# Altium schematic sheet Jammer Circuit.SchDoc
size A4
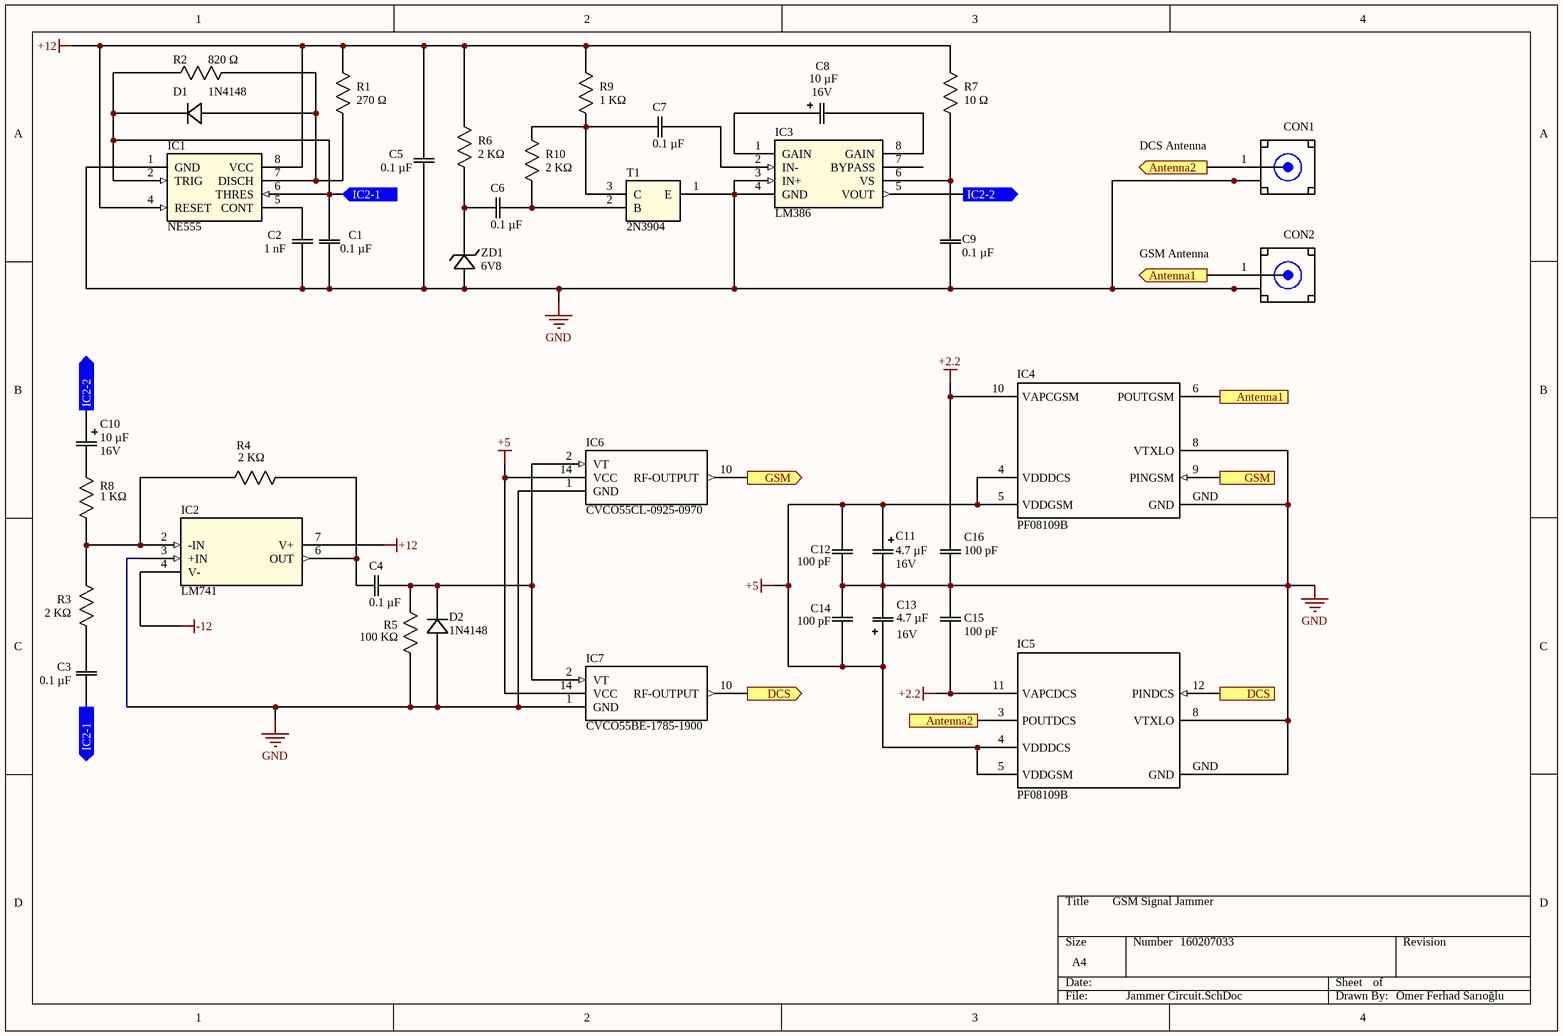
[diagram p0: Jammer Circuit.SchDoc]

## Parts
C1  value 0.1 µF  [CAP_1206J]  (hidden comment: 12062A270JAT2A)
C2  value 1 nF  [CAP_1206J]  (hidden comment: 12062A270JAT2A)
C3  value 0.1 µF  [CAP_1206J]  (hidden comment: 12062A270JAT2A)
C4  value 0.1 µF  [CAP_1206J]  (hidden comment: 12062A270JAT2A)
C5  value 0.1 µF  [CAP_1206J]  (hidden comment: 12062A270JAT2A)
C6  value 0.1 µF  [CAP_1206J]  (hidden comment: 12062A270JAT2A)
C7  value 0.1 µF  [CAP_1206J]  (hidden comment: 12062A270JAT2A)
C8  value 10 µF  Voltage: 16V  [EEE-1C]  (hidden comment: EEE-1CA221UP)
C9  value 0.1 µF  [CAP_1206J]  (hidden comment: 12062A270JAT2A)
C10  value 10 µF  Voltage: 16V  [EEE-1C]  (hidden comment: EEE-1CA221UP)
C11  value 4.7 µF  Voltage: 16V  [EEE-1C]  (hidden comment: EEE-1CA221UP)
C12  value 100 pF  [CAP_1206J]  (hidden comment: 12062A270JAT2A)
C13  value 4.7 µF  Voltage: 16V  [EEE-1C]  (hidden comment: EEE-1CA221UP)
C14  value 100 pF  [CAP_1206J]  (hidden comment: 12062A270JAT2A)
C15  value 100 pF  [CAP_1206J]  (hidden comment: 12062A270JAT2A)
C16  value 100 pF  [CAP_1206J]  (hidden comment: 12062A270JAT2A)
CON1  SMA-J-P-H-RA-TH1  [SAMTEC_SMA-J-P-H-RA-TH1]  (value not drawn)
CON2  SMA-J-P-H-RA-TH1  [SAMTEC_SMA-J-P-H-RA-TH1]  (value not drawn)
D1  1N4148  [SOD123]
D2  1N4148  [SOD123]
IC1  NE555  [D8]
IC2  LM741  [J08A]
IC3  LM386  [M08A]
IC4  PF08109B  [PCBComponent_1]
IC5  PF08109B  [PCBComponent_1]
IC6  CVCO55CL-0925-0970  [XTAL_CVCO55CW-0925-970]
IC7  CVCO55BE-1785-1900  [XTAL_CVCO55CW-0925-970]
R1  value 270 Ω  [RC1206N]  (hidden comment: RC1206JR-071M1L)
R2  value 820 Ω  [RC1206N]  (hidden comment: RC1206JR-071M1L)
R3  value 2 KΩ  [RC1206N]  (hidden comment: RC1206JR-071M1L)
R4  value 2 KΩ  [RC1206N]  (hidden comment: RC1206JR-071M1L)
R5  value 100 KΩ  [RC1206N]  (hidden comment: RC1206JR-071M1L)
R6  value 2 KΩ  [RC1206N]  (hidden comment: RC1206JR-071M1L)
R7  value 10 Ω  [RC1206N]  (hidden comment: RC1206JR-071M1L)
R8  value 1 KΩ  [RC1206N]  (hidden comment: RC1206JR-071M1L)
R9  value 1 KΩ  [RC1206N]  (hidden comment: RC1206JR-071M1L)
R10  value 2 KΩ  [RC1206N]  (hidden comment: RC1206JR-071M1L)
T1  2N3904  [TO-92_2]
ZD1  6V8  [SOD123]

## Ports
Antenna1 (in), Antenna1 (out), Antenna2 (in), Antenna2 (out), DCS (out), GSM (out), IC2-1 (in), IC2-1 (out), IC2-2 (out)

## Nets
+2.2: C15.2 C16.1 IC4.10(VAPCGSM) IC5.11(VAPCDCS)
+5: C11.1 C12.1 C13.1 C14.2 IC4.4(VDDDCS) IC4.5(VDDGSM) IC5.4(VDDDCS) IC5.5(VDDGSM) IC6.14(VCC) IC7.14(VCC)
+12: C5.1 IC1.4(RESET) IC1.8(VCC) IC2.7(V+) R1.1 R6.1 R7.1 R9.1
-12: IC2.4(V-)
GND: C1.1 C2.2 C5.2 C9.1 C11.2 C12.2 C13.2 C14.1 C15.1 C16.2 CON1.2(GND) CON1.3(GND) CON1.4(GND) CON1.5(GND) CON2.2(GND) CON2.3(GND) CON2.4(GND) CON2.5(GND) D2.2 IC1.1(GND) IC2.3(+IN) IC3.3(IN+) IC3.4(GND) IC4.8(VTXLO) IC4.GND IC5.8(VTXLO) IC5.GND IC6.1(GROUND-4) IC7.1(GROUND-4) R5.2 T1.1(E) ZD1.2
Antenna1: CON2.1(SIGNAL) IC4.6(POUTGSM) ; port Antenna1
Antenna2: CON1.1(SIGNAL) IC5.3(POUTDCS) ; port Antenna2
DCS: IC5.12(PINDCS) IC7.10(RF-OUTPUT) ; port DCS
GSM: IC4.9(PINGSM) IC6.10(RF-OUTPUT) ; port GSM
IC2-1: C1.2 C3.1 D1.1 IC1.2(TRIG) IC1.6(THRES) R2.2 ; port IC2-1
IC2-2: C10.1 IC3.5(VOUT) ; port IC2-2
NetC2_1: C2.1 IC1.5(CONT)
NetC3_2: C3.2 R3.2
NetC4_1: C4.1 IC2.6(OUT) R4.2
NetC4_2: C4.2 D2.1 IC6.2(VT) IC7.2(VT) R5.1
NetC6_1: C6.1 R6.2 ZD1.1
NetC6_2: C6.2 R10.2 T1.2(B)
NetC7_1: C7.1 R9.2 R10.1 T1.3(C)
NetC7_2: C7.2 IC3.2(IN-)
NetC8_1: C8.1 IC3.1(GAIN)
NetC8_2: C8.2 IC3.8(GAIN)
NetC9_2: C9.2 IC3.6(VS) R7.2
NetC10_2: C10.2 R8.2
NetD1_2: D1.2 IC1.7(DISCH) R1.2 R2.1
NetIC2_2: IC2.2(-IN) R3.1 R4.1 R8.1

Not connected (* = marked no-connect by the designer): IC1 3(OUT); IC2 1(OFFSETNULL) 5(OFFSETNULL) 8(NC); IC3 7(BYPASS); IC4 3(POUTDCS) 11(VAPCDCS) 12(PINDCS); IC5 6(POUTGSM) 9(PINGSM) 10(VAPCGSM); IC6 3(GROUND-6) 4(GROUND-5) 5(GROUND-8) 6(GROUND-7) 7(GROUND-10) 8(GROUND-9) 9(GROUND-1) 12(GROUND-11) 13(GROUND-2) 15(GROUND-12) 16(GROUND-3); IC7 3(GROUND-6) 4(GROUND-5) 5(GROUND-8) 6(GROUND-7) 7(GROUND-10) 8(GROUND-9) 9(GROUND-1) 12(GROUND-11) 13(GROUND-2) 15(GROUND-12) 16(GROUND-3)

## Notes on the sheet
- DCS Antenna
- GSM Antenna
- GSM Signal Jammer
- 160207033
- Ömer Ferhad Sarıoğlu

## Library data of the parts
C1-C7 C9 C12 C14-C16 = 12062A270JAT2A: Imported; Built_By: EMA_UL_Team; Vendor: AVX Corporation; Type: DEV; Manufacturer_Part_Number: 12062A270JAT2A; RefDes: RefDes
C8 C10 C11 C13 = EEE-1CA221UP: Imported; Vendor: Panasonic; Type: DEV; C: Copyright (C) 2015 Accelerated Designs. All rights reserved; Copyright: Copyright (C) 2015 Accelerated Designs. All rights reserved; Manufacturer_Part_Number: EEE-1CA221UP; RefDes: RefDes
CON1 CON2 = SMA-J-P-H-RA-TH1: Conn SMA F 0Hz to 6GHz 50Ohm Solder RA Thru-Hole Gold Tray; MF: Samtec Inc.; SnapEDA_Link: https://www.snapeda.com/parts/SMA-J-P-H-RA-TH1/Samtec%20Inc./view-part/?ref=snap; Availability: Unavailable; Price: None; Package: None; MP: SMA-J-P-H-RA-TH1; Value: *
D1 D2 = 1N4148W-13-F: Vendor: Diodes Inc; Built_By: EMA_UL_Team; Type: DEV; C: Copyright (C) 2015 Accelerated Designs. All rights reserved; Manufacturer_Part_Number: 1N4148W-13-F; RefDes: RefDes
IC1 = NE555DRG4: Imported; Manufacturer: Texas Instruments; Built_By: EMA_UL_Team; C: Copyright (C) 2015 Accelerated Designs. All rights reserved; Vendor: Texas Instruments; Manufacturer_Part_Number: NE555DRG4; RefDes: RefDes; Type: DEV; Value: Value
IC2 = LM741J: Imported; Vendor: Texas Instruments; Built_By: EMA_UL_Team; C: Copyright (C) 2015 Accelerated Designs. All rights reserved; Manufacturer_Part_Number: LM741J; RefDes: RefDes; Type: DEV; Value: Value
IC3 = LM386M-1/NOPB: Imported; Vendor: Texas Instruments; Built_By: EMA_UL_Team; C: Copyright (C) 2015 Accelerated Designs. All rights reserved; Manufacturer_Part_Number: LM386M-1/NOPB; RefDes: RefDes; Type: DEV; Value: Value
IC4 IC5 = Amplifier
IC6 IC7 = CVCO55CL-0925-0970: Oscillator, VCO; Type, Narrow Band; 925-970MHz; 12.7x12.7mm SMD; MF: Crystek Corporation; SnapEDA_Link: https://www.snapeda.com/parts/CVCO55CL-0925-0970/Crystek%20Corporation/view-part/?ref=snap; Package: QFN-16 Crystek Crystals; Price: None; MP: CVCO55CL-0925-0970; Availability: Unavailable; Value: *
R1-R10 = RC1206JR-071M1L: Imported; Vendor: Yageo; Built_By: EMA_UL_Team; C: Copyright (C) 2015 Accelerated Designs. All rights reserved; Manufacturer_Part_Number: RC1206JR-071M1L; RefDes: RefDes; Type: DEV
T1 = 2N3904: Imported; Vendor: Fairchild Semiconductor; Built_By: EMA_UL_Team; Type: DEV; C: Copyright (C) 2015 Accelerated Designs. All rights reserved; Manufacturer_Part_Number: 2N3904; RefDes: RefDes; Value: Value
ZD1 = MMSZ5221B-7: Vendor: Diodes Inc; Built_By: EMA_UL_Team; C: Copyright (C) 2015 Accelerated Designs. All rights reserved; Manufacturer_Part_Number: MMSZ5221B-7; RefDes: RefDes; Type: DEV; Value: Value